# EasyEDA schematic SCH_z80-system-1.5_2022-04-09.json

## Sheets
1 Main Board: TITLE: Z80 System - Mainboard; REV: 1.0; Date: 2022-03-21; Sheet: 1/1; Company: kgroveshok
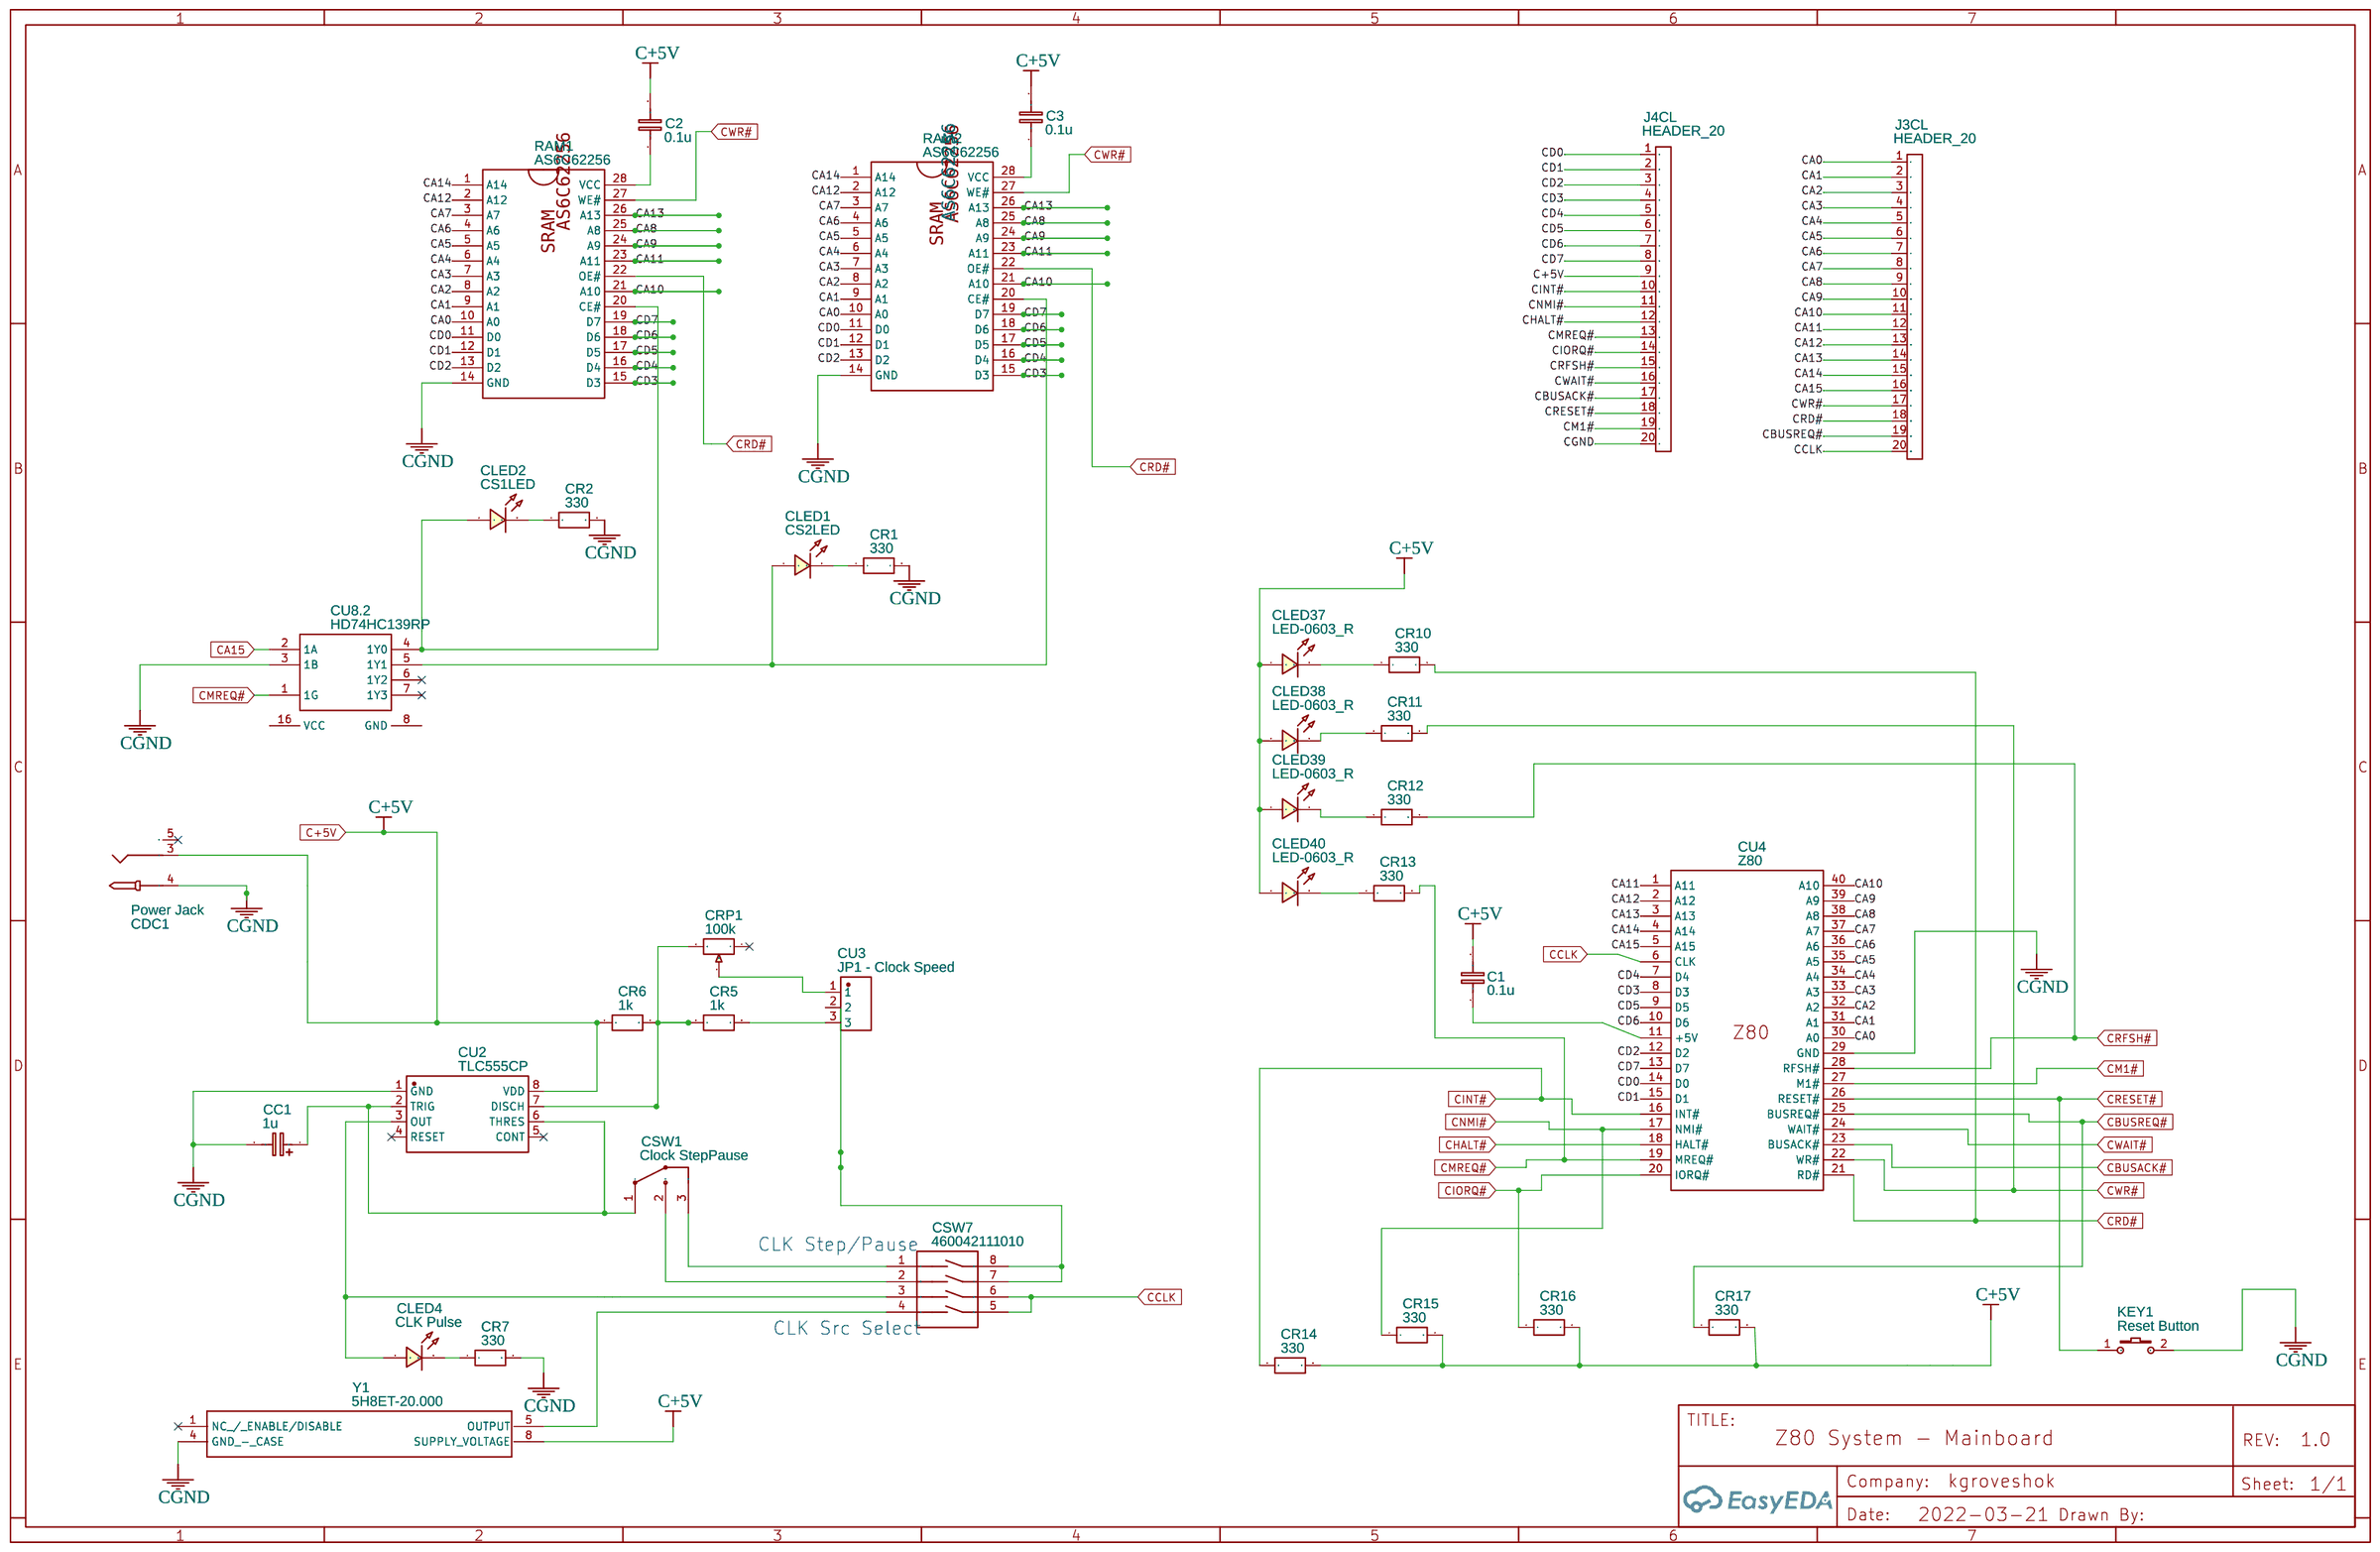
[diagram p0: Main Board]
2 Front Panel Layer: TITLE: Z80 System - Front Panel Layer and PIC Loader
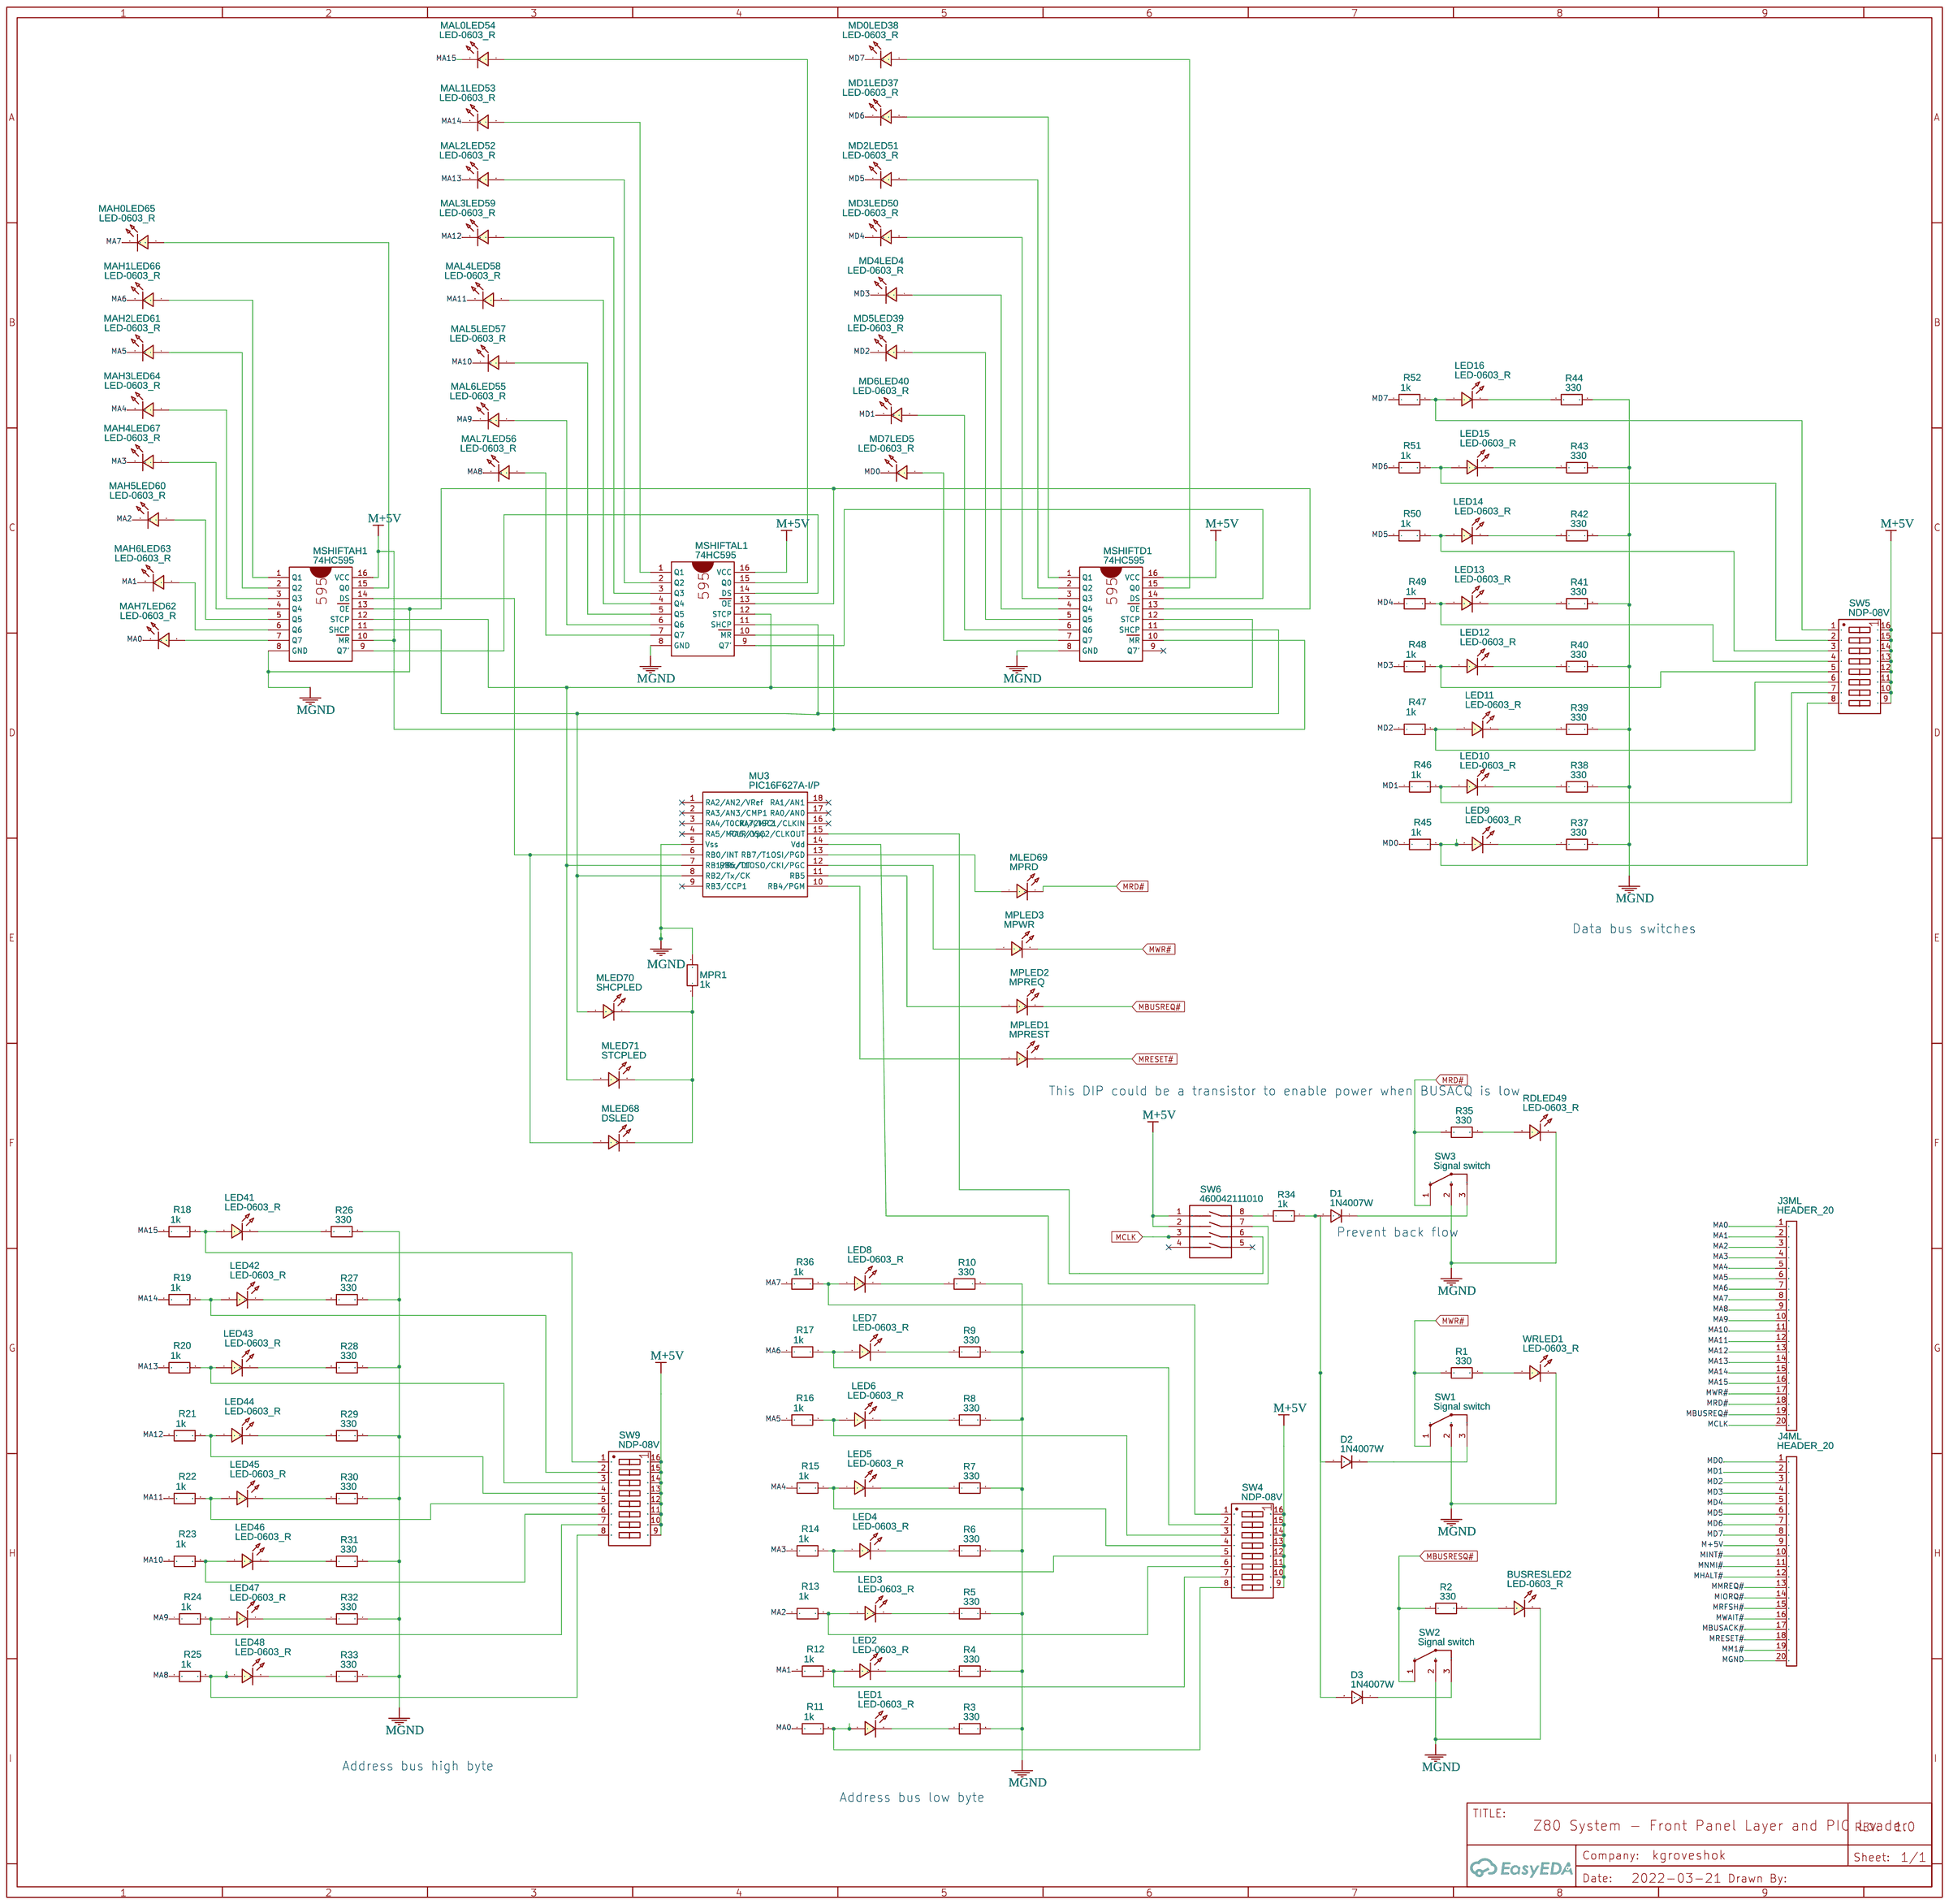
[diagram p1: Front Panel Layer]

## Parts
sheet Front Panel Layer
BUSRESLED2  LED-0603_R  [LED-5MM-2.54MM]
D1  1N4007W  [DIODE 0.4]
D2  1N4007W  [DIODE 0.4]
D3  1N4007W  [DIODE 0.4]
J3ML  HEADER_20  [HDR-M-2.54_1X20]
J4ML  HEADER_20  [HDR-M-2.54_1X20]
LED1  LED-0603_R  [LED-DIP-2.5X2.0X2.7]
LED2  LED-0603_R  [LED-DIP-2.5X2.0X2.7]
LED3  LED-0603_R  [LED-DIP-2.5X2.0X2.7]
LED4  LED-0603_R  [LED-DIP-2.5X2.0X2.7]
LED5  LED-0603_R  [LED-DIP-2.5X2.0X2.7]
LED6  LED-0603_R  [LED-DIP-2.5X2.0X2.7]
LED7  LED-0603_R  [LED-DIP-2.5X2.0X2.7]
LED8  LED-0603_R  [LED-DIP-2.5X2.0X2.7]
LED9  LED-0603_R  [LED-DIP-2.5X2.0X2.7]
LED10  LED-0603_R  [LED-DIP-2.5X2.0X2.7]
LED11  LED-0603_R  [LED-DIP-2.5X2.0X2.7]
LED12  LED-0603_R  [LED-DIP-2.5X2.0X2.7]
LED13  LED-0603_R  [LED-DIP-2.5X2.0X2.7]
LED14  LED-0603_R  [LED-DIP-2.5X2.0X2.7]
LED15  LED-0603_R  [LED-DIP-2.5X2.0X2.7]
LED16  LED-0603_R  [LED-DIP-2.5X2.0X2.7]
LED41  LED-0603_R  [LED-DIP-2.5X2.0X2.7]
LED42  LED-0603_R  [LED-DIP-2.5X2.0X2.7]
LED43  LED-0603_R  [LED-DIP-2.5X2.0X2.7]
LED44  LED-0603_R  [LED-DIP-2.5X2.0X2.7]
LED45  LED-0603_R  [LED-DIP-2.5X2.0X2.7]
LED46  LED-0603_R  [LED-DIP-2.5X2.0X2.7]
LED47  LED-0603_R  [LED-DIP-2.5X2.0X2.7]
LED48  LED-0603_R  [LED-DIP-2.5X2.0X2.7]
MAH0LED65  LED-0603_R  [LED-DIP-2.5X2.0X2.7]
MAH1LED66  LED-0603_R  [LED-DIP-2.5X2.0X2.7]
MAH2LED61  LED-0603_R  [LED-DIP-2.5X2.0X2.7]
MAH3LED64  LED-0603_R  [LED-DIP-2.5X2.0X2.7]
MAH4LED67  LED-0603_R  [LED-DIP-2.5X2.0X2.7]
MAH5LED60  LED-0603_R  [LED-DIP-2.5X2.0X2.7]
MAH6LED63  LED-0603_R  [LED-DIP-2.5X2.0X2.7]
MAH7LED62  LED-0603_R  [LED-DIP-2.5X2.0X2.7]
MAL0LED54  LED-0603_R  [LED-DIP-2.5X2.0X2.7]
MAL1LED53  LED-0603_R  [LED-DIP-2.5X2.0X2.7]
MAL2LED52  LED-0603_R  [LED-DIP-2.5X2.0X2.7]
MAL3LED59  LED-0603_R  [LED-DIP-2.5X2.0X2.7]
MAL4LED58  LED-0603_R  [LED-DIP-2.5X2.0X2.7]
MAL5LED57  LED-0603_R  [LED-DIP-2.5X2.0X2.7]
MAL6LED55  LED-0603_R  [LED-DIP-2.5X2.0X2.7]
MAL7LED56  LED-0603_R  [LED-DIP-2.5X2.0X2.7]
MD0LED38  LED-0603_R  [LED-DIP-2.5X2.0X2.7]
MD1LED37  LED-0603_R  [LED-DIP-2.5X2.0X2.7]
MD2LED51  LED-0603_R  [LED-DIP-2.5X2.0X2.7]
MD3LED50  LED-0603_R  [LED-DIP-2.5X2.0X2.7]
MD4LED4  LED-0603_R  [LED-DIP-2.5X2.0X2.7]
MD5LED39  LED-0603_R  [LED-DIP-2.5X2.0X2.7]
MD6LED40  LED-0603_R  [LED-DIP-2.5X2.0X2.7]
MD7LED5  LED-0603_R  [LED-DIP-2.5X2.0X2.7]
MLED68  DSLED  [LED-DIP-2.5X2.0X2.7]
MLED69  MPRD  [LED-DIP-2.5X2.0X2.7]
MLED70  SHCPLED  [LED-DIP-2.5X2.0X2.7]
MLED71  STCPLED  [LED-DIP-2.5X2.0X2.7]
MPLED1  MPREST  [LED-DIP-2.5X2.0X2.7]
MPLED2  MPREQ  [LED-DIP-2.5X2.0X2.7]
MPLED3  MPWR  [LED-DIP-2.5X2.0X2.7]
MPR1  1k  [1/8W RESISTOR]
MSHIFTAH1  74HC595  [74HC595]
MSHIFTAL1  74HC595  [74HC595]
MSHIFTD1  74HC595  [74HC595]
MU3  PIC16F627A-I/P  [PIC16F627A-I/P]
R1  330  [1/8W RESISTOR]
R2  330  [1/8W RESISTOR]
R3  330  [1/8W RESISTOR]
R4  330  [1/8W RESISTOR]
R5  330  [1/8W RESISTOR]
R6  330  [1/8W RESISTOR]
R7  330  [1/8W RESISTOR]
R8  330  [1/8W RESISTOR]
R9  330  [1/8W RESISTOR]
R10  330  [1/8W RESISTOR]
R11  1k  [1/8W RESISTOR]
R12  1k  [1/8W RESISTOR]
R13  1k  [1/8W RESISTOR]
R14  1k  [1/8W RESISTOR]
R15  1k  [1/8W RESISTOR]
R16  1k  [1/8W RESISTOR]
R17  1k  [1/8W RESISTOR]
R18  1k  [1/8W RESISTOR]
R19  1k  [1/8W RESISTOR]
R20  1k  [1/8W RESISTOR]
R21  1k  [1/8W RESISTOR]
R22  1k  [1/8W RESISTOR]
R23  1k  [1/8W RESISTOR]
R24  1k  [1/8W RESISTOR]
R25  1k  [1/8W RESISTOR]
R26  330  [1/8W RESISTOR]
R27  330  [1/8W RESISTOR]
R28  330  [1/8W RESISTOR]
R29  330  [1/8W RESISTOR]
R30  330  [1/8W RESISTOR]
R31  330  [1/8W RESISTOR]
R32  330  [1/8W RESISTOR]
R33  330  [1/8W RESISTOR]
R34  1k  [1/8W RESISTOR]
R35  330  [1/8W RESISTOR]
R36  1k  [1/8W RESISTOR]
R37  330  [1/8W RESISTOR]
R38  330  [1/8W RESISTOR]
R39  330  [1/8W RESISTOR]
R40  330  [1/8W RESISTOR]
R41  330  [1/8W RESISTOR]
R42  330  [1/8W RESISTOR]
R43  330  [1/8W RESISTOR]
R44  330  [1/8W RESISTOR]
R45  1k  [1/8W RESISTOR]
R46  1k  [1/8W RESISTOR]
R47  1k  [1/8W RESISTOR]
R48  1k  [1/8W RESISTOR]
R49  1k  [1/8W RESISTOR]
R50  1k  [1/8W RESISTOR]
R51  1k  [1/8W RESISTOR]
R52  1k  [1/8W RESISTOR]
RDLED49  LED-0603_R  [LED-DIP-2.5X2.0X2.7]
SW1  Signal switch  [KEY-TH_100GMICROSWITCH]
SW2  Signal switch  [KEY-TH_100GMICROSWITCH]
SW3  Signal switch  [KEY-TH_100GMICROSWITCH]
SW4  NDP-08V  [SW-TH_NDP-08V]
SW5  NDP-08V  [SW-TH_NDP-08V]
SW6  460042111010  [SW-TH_4P-P2.54_460042111010-1]
SW9  NDP-08V  [SW-TH_NDP-08V]
WRLED1  LED-0603_R  [LED-DIP-2.5X2.0X2.7]
sheet Main Board
C1  0.1u  [CAPACITOR SM]
C2  0.1u  [CAPACITOR SM]
C3  0.1u  [CAPACITOR SM]
CC1  1u  [CAPTH ELECTROLTIC 35V]
CDC1  Power Jack  [DC-IN-TH_KH-DC-002-1.0]
CLED1  CS2LED  [LED-DIP-2.5X2.0X2.7]
CLED2  CS1LED  [LED-DIP-2.5X2.0X2.7]
CLED4  CLK Pulse  [LED-DIP-2.5X2.0X2.7]
CLED37  LED-0603_R  [LED-DIP-2.5X2.0X2.7]
CLED38  LED-0603_R  [LED-DIP-2.5X2.0X2.7]
CLED39  LED-0603_R  [LED-DIP-2.5X2.0X2.7]
CLED40  LED-0603_R  [LED-DIP-2.5X2.0X2.7]
CR1  330  [1/8W RESISTOR]
CR2  330  [1/8W RESISTOR]
CR5  1k  [1/8W RESISTOR]
CR6  1k  [1/8W RESISTOR]
CR7  330  [1/8W RESISTOR]
CR10  330  [1/8W RESISTOR]
CR11  330  [1/8W RESISTOR]
CR12  330  [1/8W RESISTOR]
CR13  330  [1/8W RESISTOR]
CR14  330  [1/8W RESISTOR]
CR15  330  [1/8W RESISTOR]
CR16  330  [1/8W RESISTOR]
CR17  330  [1/8W RESISTOR]
CRP1  100k  [RES-ADJ-TH_3386P]
CSW1  Clock StepPause  [KEY-TH_100GMICROSWITCH]
CSW7  460042111010  [SW-TH_4P-P2.54_460042111010-1]
CU2  TLC555CP  [DIP-8_L9.7-W6.4-P2.54-LS7.6-BL]
CU3  JP1 - Clock Speed  [HDR-TH_3P-P2.54-V-M-A]
CU4  Z80  [40PIN-Z80DIP]
CU8  HD74HC139RP  [CD74HC4052E]  (section 2)
J3CL  HEADER_20  [HDR-M-2.54_1X20]
J4CL  HEADER_20  [HDR-M-2.54_1X20]
KEY1  Reset Button  [SW_PUSH-12MM_KICAD]
RAM1  AS6C62256  [PDIP-28]
RAM2  AS6C62256  [PDIP-28]
Y1  5H8ET-20.000  [5H8ET20000]

## Library data of the parts
BUSRESLED2 CLED1 CLED2 CLED4 CLED37-CLED40 LED1-LED16 LED41-LED48 MAH0LED65 MAH1LED66 MAH2LED61 MAH3LED64 MAH4LED67 MAH5LED60 MAH6LED63 MAH7LED62 MAL0LED54 MAL1LED53 MAL2LED52 MAL3LED59 MAL4LED58 MAL5LED57 MAL6LED55 MAL7LED56 MD0LED38 MD1LED37 MD2LED51 MD3LED50 MD4LED4 MD5LED39 MD6LED40 MD7LED5 MLED68-MLED71 MPLED1-MPLED3 RDLED49 WRLED1 = LED-0603_R: Manufacturer: EVERLIGHT(台湾亿光); Manufacturer Part: 19-217/R6C-AL1M2VY/3T; Supplier Part: C72044; Supplier: LCSC; Contributor: LCEDA_01
D1-D3 = 1N4007W: Supplier: LCSC; Supplier Part: C328592; Manufacturer: BLUE ROCKET; Contributor: LCEDA_Lib
J3CL J3ML J4CL J4ML = HEADER_20
CR1 CR2 CR5-CR7 CR10-CR17 MPR1 R1-R52 = R_0603_EU: Contributor: LCEDA_Lib
MSHIFTAH1 MSHIFTAL1 MSHIFTD1 = 74HC595: Contributor: embeddedpcb2019
MU3 = PIC16F627A-I/P: Manufacturer: Microchip; Manufacturer Part: PIC16F627A; link: https://www.microchip.com/wwwproducts/en/PIC16F627A; Contributor: Guest
CSW1 SW1-SW3 = Jaw handle left twins ROHS 100g Micro Switch: Supplier: LCSC; Manufacturer: ReliaPro; Supplier Part: C3668
SW4 SW5 SW9 = NDP-08V: Supplier: LCSC; Supplier Part: C699457; Manufacturer: Diptronics; Contributor: LCSC; JLCPCB Part Class: Extended Part
CSW7 SW6 = 460042111010: Supplier: LCSC; Supplier Part: C2924799; Manufacturer: LEYCONN(联益康); JLCPCB Part Class: Extended Part; Contributor: LCSC
C1-C3 = C_0603_EU: Contributor: LCEDA_Lib
CC1 = C_Tan_SMD_A_EU: Contributor: LCEDA_Lib
CDC1 = KH-DC-002-1.0: Supplier: LCSC; Supplier Part: C2847165; Manufacturer: kinghelm(金航标); Contributor: LCSC; JLCPCB Part Class: Extended Part
CRP1 = R_3386P_EU: Supplier: LCSC; Contributor: LCEDA_Lib; Value(Ω): 10K
CU2 = TLC555CP: Supplier: LCSC; Supplier Part: C910886; Manufacturer: TI(德州仪器); Contributor: LCSC; JLCPCB Part Class: Extended Part
CU3 = JUMPER3: Supplier: LCSC; Supplier Part: C2940050; Manufacturer: null; Manufacturer Part: Jumper3; Contributor: LCSC; JLCPCB Part Class: Extended Part
CU4 = Z80: Manufacturer: Zilog; Manufacturer Part: Z84C0008PEG; Supplier Part: 625-8918; Supplier: RS-Online; link: https://uk.rs-online.com/web/p/microcontrollers/6258918/; Contributor: Mjs73
CU8 = HD74HC139RP: Dual 2-to-4 Line Decoders  Demultiplexers; subpart_no: 2
KEY1 = K2-3.6×6.1_SMD: Supplier Part: C118141; Supplier: LCSC; Manufacturer Part: K2-1107ST-A4SW-06; Contributor: LCEDA_Lib; 制造商: 韩国韩荣
RAM1 RAM2 = AS6C62256: Manufacturer: Alliance Memory; Manufacturer Part: AS6C62256-55PCN; Supplier: Mouser; Supplier Part: 913-AS6C62256-55PCN; Contributor: Torbsi
Y1 = 5H8ET-20.000: Contributor: nikmiddleton

## Nets
C+5V: C1.2 C2.2 C3.2 CDC1.3 CLED37.1 CLED38.1 CLED39.1 CLED40.1 CR6.2 CR14.2 CR15.2 CR16.2 CR17.2 CU2.8(VDD) J4CL.9 Y1.8(SUPPLY_VOLTAGE)
CA0: CU4.30(A0) J3CL.1 RAM1.10(A0) RAM2.10(A0)
CA1: CU4.31(A1) J3CL.2 RAM1.9(A1) RAM2.9(A1)
CA2: CU4.32(A2) J3CL.3 RAM1.8(A2) RAM2.8(A2)
CA3: CU4.33(A3) J3CL.4 RAM1.7(A3) RAM2.7(A3)
CA4: CU4.34(A4) J3CL.5 RAM1.6(A4) RAM2.6(A4)
CA5: CU4.35(A5) J3CL.6 RAM1.5(A5) RAM2.5(A5)
CA6: CU4.36(A6) J3CL.7 RAM1.4(A6) RAM2.4(A6)
CA7: CU4.37(A7) J3CL.8 RAM1.3(A7) RAM2.3(A7)
CA8: CU4.38(A8) J3CL.9 RAM1.25(A8) RAM2.25(A8)
CA9: CU4.39(A9) J3CL.10 RAM1.24(A9) RAM2.24(A9)
CA10: CU4.40(A10) J3CL.11 RAM1.21(A10) RAM2.21(A10)
CA11: CU4.1(A11) J3CL.12 RAM1.23(A11) RAM2.23(A11)
CA12: CU4.2(A12) J3CL.13 RAM1.2(A12) RAM2.2(A12)
CA13: CU4.3(A13) J3CL.14 RAM1.26(A13) RAM2.26(A13)
CA14: CU4.4(A14) J3CL.15 RAM1.1(A14) RAM2.1(A14)
CA15: CU4.5(A15) CU8.2(1A) J3CL.16
CBUSACK#: CU4.23(BUSACK#) J4CL.17
CBUSREQ#: CR17.1 CU4.25(BUSREQ#) J3CL.19
CCLK: CSW7.5 CSW7.6 CU4.6(CLK) J3CL.20
CD0: CU4.14(D0) J4CL.1 RAM1.11(D0) RAM2.11(D0)
CD1: CU4.15(D1) J4CL.2 RAM1.12(D1) RAM2.12(D1)
CD2: CU4.12(D2) J4CL.3 RAM1.13(D2) RAM2.13(D2)
CD3: CU4.8(D3) J4CL.4 RAM1.15(D3) RAM2.15(D3)
CD4: CU4.7(D4) J4CL.5 RAM1.16(D4) RAM2.16(D4)
CD5: CU4.9(D5) J4CL.6 RAM1.17(D5) RAM2.17(D5)
CD6: CU4.10(D6) J4CL.7 RAM1.18(D6) RAM2.18(D6)
CD7: CU4.13(D7) J4CL.8 RAM1.19(D7) RAM2.19(D7)
CGND: CC1.2 CDC1.4 CR1.2 CR2.2 CR7.2 CU2.1(GND) CU4.29(GND) CU8.3(1B) J4CL.20 KEY1.2 RAM1.14(GND) RAM2.14(GND) Y1.4(GND_-_CASE)
CHALT#: CU4.18(HALT#) J4CL.12
CINT#: CR14.1 CU4.16(INT#) J4CL.10
CIORQ#: CR16.1 CU4.20(IORQ#) J4CL.14
CM1#: CU4.27(M1#) J4CL.19
CMREQ#: CR13.2 CU4.19(MREQ#) CU8.1(1G) J4CL.13
CNMI#: CR15.1 CU4.17(NMI#) J4CL.11
CRD#: CR10.2 CU4.21(RD#) J3CL.18 RAM1.22(OE#) RAM2.22(OE#)
CRESET#: CU4.26(RESET#) J4CL.18 KEY1.1
CRFSH#: CR12.2 CU4.28(RFSH#) J4CL.15
CWAIT#: CU4.24(WAIT#) J4CL.16
CWR#: CR11.2 CU4.22(WR#) J3CL.17 RAM1.27(WE#) RAM2.27(WE#)
M+5V: J4ML.9 MSHIFTAH1.10(MR) MSHIFTAH1.16(VCC) MSHIFTAL1.10(MR) MSHIFTAL1.16(VCC) MSHIFTD1.10(MR) MSHIFTD1.16(VCC) SW4.9(PIN9) SW4.10(PIN10) SW4.11(PIN11) SW4.12(PIN12) SW4.13(PIN13) SW4.14(PIN14) SW4.15(PIN15) SW4.16(PIN16) SW5.9(PIN9) SW5.10(PIN10) SW5.11(PIN11) SW5.12(PIN12) SW5.13(PIN13) SW5.14(PIN14) SW5.15(PIN15) SW5.16(PIN16) SW6.1 SW6.2 SW9.9(PIN9) SW9.10(PIN10) SW9.11(PIN11) SW9.12(PIN12) SW9.13(PIN13) SW9.14(PIN14) SW9.15(PIN15) SW9.16(PIN16)
MA0: J3ML.1 MAH7LED62.2 R11.1
MA1: J3ML.2 MAH6LED63.2 R12.1
MA2: J3ML.3 MAH5LED60.2 R13.1
MA3: J3ML.4 MAH4LED67.2 R14.1
MA4: J3ML.5 MAH3LED64.2 R15.1
MA5: J3ML.6 MAH2LED61.2 R16.1
MA6: J3ML.7 MAH1LED66.2 R17.1
MA7: J3ML.8 MAH0LED65.2 R36.1
MA8: J3ML.9 MAL7LED56.2 R25.1
MA9: J3ML.10 MAL6LED55.2 R24.1
MA10: J3ML.11 MAL5LED57.2 R23.1
MA11: J3ML.12 MAL4LED58.2 R22.1
MA12: J3ML.13 MAL3LED59.2 R21.1
MA13: J3ML.14 MAL2LED52.2 R20.1
MA14: J3ML.15 MAL1LED53.2 R19.1
MA15: J3ML.16 MAL0LED54.2 R18.1
MBUSACK#: J4ML.17
MBUSREQ#: J3ML.19 MPLED2.2
MBUSRESQ#: R2.1 SW2.1
MCLK: J3ML.20 SW6.3
MD0: J4ML.1 MD7LED5.2 R45.1
MD1: J4ML.2 MD6LED40.2 R46.1
MD2: J4ML.3 MD5LED39.2 R47.1
MD3: J4ML.4 MD4LED4.2 R48.1
MD4: J4ML.5 MD3LED50.2 R49.1
MD5: J4ML.6 MD2LED51.2 R50.1
MD6: J4ML.7 MD1LED37.2 R51.1
MD7: J4ML.8 MD0LED38.2 R52.1
MGND: BUSRESLED2.2 J4ML.20 MPR1.2 MSHIFTAH1.8(GND) MSHIFTAH1.13(OE) MSHIFTAL1.8(GND) MSHIFTAL1.13(OE) MSHIFTD1.8(GND) MSHIFTD1.13(OE) MU3.5(Vss) R3.2 R4.2 R5.2 R6.2 R7.2 R8.2 R9.2 R10.2 R26.2 R27.2 R28.2 R29.2 R30.2 R31.2 R32.2 R33.2 R37.2 R38.2 R39.2 R40.2 R41.2 R42.2 R43.2 R44.2 RDLED49.2 SW1.2 SW2.2 SW3.2 WRLED1.2
MHALT#: J4ML.12
MINT#: J4ML.10
MIORQ#: J4ML.14
MM1#: J4ML.19
MMREQ#: J4ML.13
MNMI#: J4ML.11
MRD#: J3ML.18 MLED69.2 R35.1 SW3.1
MRESET#: J4ML.18 MPLED1.2
MRFSH#: J4ML.15
MWAIT#: J4ML.16
MWR#: J3ML.17 MPLED3.2 R1.1 SW1.1
Net-(BUSRESLED2-1): BUSRESLED2.1 R2.2
Net-(C1-1): C1.1 CU4.11(+5V)
Net-(C2-1): C2.1 RAM1.28(VCC)
Net-(C3-1): C3.1 RAM2.28(VCC)
Net-(CC1-1): CC1.1 CSW1.1 CU2.2(TRIG) CU2.6(THRES)
Net-(CLED1-1): CLED1.1 CU8.5(1Y1) RAM2.20(CE#)
Net-(CLED1-2): CLED1.2 CR1.1
Net-(CLED2-1): CLED2.1 CU8.4(1Y0) RAM1.20(CE#)
Net-(CLED2-2): CLED2.2 CR2.1
Net-(CLED4-1): CLED4.1 CSW7.3 CU2.3(OUT)
Net-(CLED4-2): CLED4.2 CR7.1
Net-(CLED37-2): CLED37.2 CR10.1
Net-(CLED38-2): CLED38.2 CR11.1
Net-(CLED39-2): CLED39.2 CR12.1
Net-(CLED40-2): CLED40.2 CR13.1
Net-(CR5-1): CR5.1 CR6.1 CRP1.3 CU2.7(DISCH)
Net-(CR5-2): CR5.2 CU3.3
Net-(CRP1-2): CRP1.2 CU3.1
Net-(CSW1-2): CSW1.2 CSW7.2
Net-(CSW1-3): CSW1.3 CSW7.1
Net-(CSW7-4): CSW7.4 Y1.5(OUTPUT)
Net-(CSW7-7): CSW7.7 CSW7.8 CU3.2
Net-(D1-1): D1.1 SW3.3
Net-(D1-2): D1.2 D2.2 D3.2 R34.2
Net-(D2-1): D2.1 SW1.3
Net-(D3-1): D3.1 SW2.3
Net-(LED1-1): LED1.1 R11.2 SW4.8(PIN8)
Net-(LED1-2): LED1.2 R3.1
Net-(LED2-1): LED2.1 R12.2 SW4.7(PIN7)
Net-(LED2-2): LED2.2 R4.1
Net-(LED3-1): LED3.1 R13.2 SW4.6(PIN6)
Net-(LED3-2): LED3.2 R5.1
Net-(LED4-1): LED4.1 R14.2 SW4.5(PIN5)
Net-(LED4-2): LED4.2 R6.1
Net-(LED5-1): LED5.1 R15.2 SW4.4(PIN4)
Net-(LED5-2): LED5.2 R7.1
Net-(LED6-1): LED6.1 R16.2 SW4.3(PIN3)
Net-(LED6-2): LED6.2 R8.1
Net-(LED7-1): LED7.1 R17.2 SW4.2(PIN2)
Net-(LED7-2): LED7.2 R9.1
Net-(LED8-1): LED8.1 R36.2 SW4.1(PIN1)
Net-(LED8-2): LED8.2 R10.1
Net-(LED9-1): LED9.1 R45.2 SW5.8(PIN8)
Net-(LED9-2): LED9.2 R37.1
Net-(LED10-1): LED10.1 R46.2 SW5.7(PIN7)
Net-(LED10-2): LED10.2 R38.1
Net-(LED11-1): LED11.1 R47.2 SW5.6(PIN6)
Net-(LED11-2): LED11.2 R39.1
Net-(LED12-1): LED12.1 R48.2 SW5.5(PIN5)
Net-(LED12-2): LED12.2 R40.1
Net-(LED13-1): LED13.1 R49.2 SW5.4(PIN4)
Net-(LED13-2): LED13.2 R41.1
Net-(LED14-1): LED14.1 R50.2 SW5.3(PIN3)
Net-(LED14-2): LED14.2 R42.1
Net-(LED15-1): LED15.1 R51.2 SW5.2(PIN2)
Net-(LED15-2): LED15.2 R43.1
Net-(LED16-1): LED16.1 R52.2 SW5.1(PIN1)
Net-(LED16-2): LED16.2 R44.1
Net-(LED41-1): LED41.1 R18.2 SW9.1(PIN1)
Net-(LED41-2): LED41.2 R26.1
Net-(LED42-1): LED42.1 R19.2 SW9.2(PIN2)
Net-(LED42-2): LED42.2 R27.1
Net-(LED43-1): LED43.1 R20.2 SW9.3(PIN3)
Net-(LED43-2): LED43.2 R28.1
Net-(LED44-1): LED44.1 R21.2 SW9.4(PIN4)
Net-(LED44-2): LED44.2 R29.1
Net-(LED45-1): LED45.1 R22.2 SW9.5(PIN5)
Net-(LED45-2): LED45.2 R30.1
Net-(LED46-1): LED46.1 R23.2 SW9.6(PIN6)
Net-(LED46-2): LED46.2 R31.1
Net-(LED47-1): LED47.1 R24.2 SW9.7(PIN7)
Net-(LED47-2): LED47.2 R32.1
Net-(LED48-1): LED48.1 R25.2 SW9.8(PIN8)
Net-(LED48-2): LED48.2 R33.1
Net-(MAH0LED65-1): MAH0LED65.1 MSHIFTAH1.15(Q0)
Net-(MAH1LED66-1): MAH1LED66.1 MSHIFTAH1.1(Q1)
Net-(MAH2LED61-1): MAH2LED61.1 MSHIFTAH1.2(Q2)
Net-(MAH3LED64-1): MAH3LED64.1 MSHIFTAH1.3(Q3)
Net-(MAH4LED67-1): MAH4LED67.1 MSHIFTAH1.4(Q4)
Net-(MAH5LED60-1): MAH5LED60.1 MSHIFTAH1.5(Q5)
Net-(MAH6LED63-1): MAH6LED63.1 MSHIFTAH1.6(Q6)
Net-(MAH7LED62-1): MAH7LED62.1 MSHIFTAH1.7(Q7)
Net-(MAL0LED54-1): MAL0LED54.1 MSHIFTAL1.15(Q0)
Net-(MAL1LED53-1): MAL1LED53.1 MSHIFTAL1.1(Q1)
Net-(MAL2LED52-1): MAL2LED52.1 MSHIFTAL1.2(Q2)
Net-(MAL3LED59-1): MAL3LED59.1 MSHIFTAL1.3(Q3)
Net-(MAL4LED58-1): MAL4LED58.1 MSHIFTAL1.4(Q4)
Net-(MAL5LED57-1): MAL5LED57.1 MSHIFTAL1.5(Q5)
Net-(MAL6LED55-1): MAL6LED55.1 MSHIFTAL1.6(Q6)
Net-(MAL7LED56-1): MAL7LED56.1 MSHIFTAL1.7(Q7)
Net-(MD0LED38-1): MD0LED38.1 MSHIFTD1.15(Q0)
Net-(MD1LED37-1): MD1LED37.1 MSHIFTD1.1(Q1)
Net-(MD2LED51-1): MD2LED51.1 MSHIFTD1.2(Q2)
Net-(MD3LED50-1): MD3LED50.1 MSHIFTD1.3(Q3)
Net-(MD4LED4-1): MD4LED4.1 MSHIFTD1.4(Q4)
Net-(MD5LED39-1): MD5LED39.1 MSHIFTD1.5(Q5)
Net-(MD6LED40-1): MD6LED40.1 MSHIFTD1.6(Q6)
Net-(MD7LED5-1): MD7LED5.1 MSHIFTD1.7(Q7)
Net-(MLED68-1): MLED68.1 MSHIFTAH1.14(DS) MU3.6(RB0/INT)
Net-(MLED68-2): MLED68.2 MLED70.2 MLED71.2 MPR1.1
Net-(MLED69-1): MLED69.1 MU3.13(RB7/T1OSI/PGD)
Net-(MLED70-1): MLED70.1 MSHIFTAH1.11(SHCP) MSHIFTAL1.11(SHCP) MSHIFTD1.11(SHCP) MU3.8(RB2/Tx/CK)
Net-(MLED71-1): MLED71.1 MSHIFTAH1.12(STCP) MSHIFTAL1.12(STCP) MSHIFTD1.12(STCP) MU3.7(RB1/Rx/DT)
Net-(MPLED1-1): MPLED1.1 MU3.10(RB4/PGM)
Net-(MPLED2-1): MPLED2.1 MU3.11(RB5)
Net-(MPLED3-1): MPLED3.1 MU3.12(RB6/T1OSO/CKI/PGC)
Net-(MSHIFTAH1-9): MSHIFTAH1.9(Q7') MSHIFTAL1.14(DS)
Net-(MSHIFTAL1-9): MSHIFTAL1.9(Q7') MSHIFTD1.14(DS)
Net-(MU3-14): MU3.14(Vdd) SW6.7
Net-(MU3-15): MU3.15(RA6/OSC2/CLKOUT) SW6.6
Net-(R1-2): R1.2 WRLED1.1
Net-(R34-1): R34.1 SW6.8
Net-(R35-2): R35.2 RDLED49.1

Not connected (* = marked no-connect by the designer): CDC1 5*; CRP1 1*; CU2 4(RESET)* 5(CONT)*; CU8 6(1Y2)* 7(1Y3)* 8(GND) 16(VCC); MSHIFTD1 9(Q7')*; MU3 1(RA2/AN2/VRef)* 2(RA3/AN3/CMP1)* 3(RA4/T0CKI/CMP2)* 4(RA5/MCLR/Vpp)* 9(RB3/CCP1)* 16(RA7/ISC1/CLKIN)* 17(RA0/AN0)* 18(RA1/AN1)*; SW6 4* 5*; Y1 1(NC_/_ENABLE/DISABLE)*

## Notes on the sheets
sheet 1
- AS6C62256
- CLK Step/Pause
- CLK Src Select
sheet 2
- Data bus switches
- This DIP could be a transistor to enable power when BUSACQ is low
- Prevent back flow
- Address bus high byte
- Address bus low byte
